# EAGLE schematic bread-supply_v0 (EAGLE 5.07)
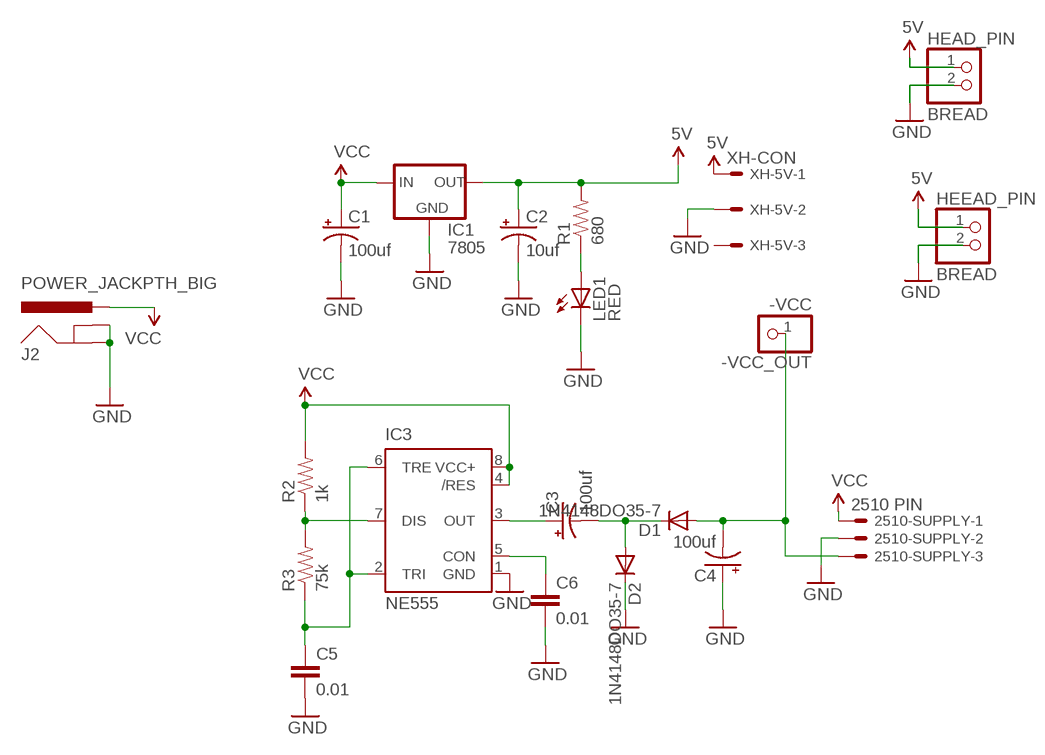
[diagram p0: schematic, sheet 1]

## Parts
2510-SUPPLY  2510 PIN  22-23-2031  [22-23-2031]
-VCC_OUT  -VCC  PINHD-1X1  [1X01]
C1  100uf  CAP_POLPTH1  [CPOL-RADIAL-100UF-25V]
C2  10uf  CAP_POLPTH2  [CPOL-RADIAL-10UF-25V]
C3  100uf  CAP_POLPTH1  [CPOL-RADIAL-100UF-25V]
C4  100uf  CAP_POLPTH1  [CPOL-RADIAL-100UF-25V]
C5  0.01  CAPPTH  [CAP-PTH-SMALL]
C6  0.01  CAPPTH  [CAP-PTH-SMALL]
D1  1N4148DO35-7  [DO35-7]
D2  1N4148DO35-7  [DO35-7]
HEAD_PIN  BREAD  PINHD-1X2  [1X02]
HEEAD_PIN  BREAD  PINHD-1X2  [1X02]
IC1  7805  V_REG_78XXSIDE  [78XXL]
IC3  NE555  [DIL-08]
J2  POWER_JACKPTH_BIG  [POWER_JACK_2.1X5.5_BIG_PTH]
LED1  RED  LED3MM  [LED3MM]
R1  680  RESISTORPTH1  [AXIAL-0.3]
R2  1k  RESISTORPTH1  [AXIAL-0.3]
R3  75k  RESISTORPTH1  [AXIAL-0.3]
XH-5V  XH-CON  22-27-2031-03  [6410-03]

## Nets
5V: C2.1(+) HEAD_PIN.1 HEEAD_PIN.1 IC1.OUT R1.P$2 XH-5V.1
GND: 2510-SUPPLY.2 C1.2(-) C2.2(-) C4.1(+) C5.2 C6.2 D2.C HEAD_PIN.2 HEEAD_PIN.2 IC1.GND IC3.1(GND) J2.GND J2.GNDBREAK LED1.K(C) XH-5V.2
N$2: IC3.7(DIS) R2.P$1 R3.P$2
N$3: C5.1 IC3.2(TRI) IC3.6(TRE) R3.P$1
N$5: C6.1 IC3.5(CON)
N$6: C3.1(+) IC3.3(OUT)
N$7: C3.2(-) D1.C D2.A
N$8: 2510-SUPPLY.3 -VCC_OUT.1 C4.2(-) D1.A
N$10: LED1.A R1.P$1
VCC: 2510-SUPPLY.1 C1.1(+) IC1.IN IC3.4(/RES) IC3.8(VCC+) J2.PWR R2.P$2
Unconnected: XH-5V.3

## Library data of the parts
2510-SUPPLY = con-molex:22-23-2031: .100" (2.54mm) Center Header - 3 Pin
-VCC_OUT = pinhead:PINHD-1X1: PIN HEADER
C1-C4 = SparkFun:CAP_POL: Capacitor Polarized These are standard SMD and PTH capacitors. Normally 10uF, 47uF, and 100uF in electrolytic and tantalum varieties. Always verify the external diameter of the through hole cap, it varies with capacity, voltage, and manufacturer. The EIA devices should be standard.
C5 C6 = SparkFun:CAP: Capacitor Standard 0603 ceramic capacitor, and 0.1" leaded capacitor.
D1 D2 = diode:1N4148: DIODE high speed (Philips)
HEAD_PIN HEEAD_PIN = pinhead:PINHD-1X2: PIN HEADER
IC1 = SparkFun:V_REG_78XX: Voltage Regulator Standard 7805 5V regulator. IGO (Input Ground Output). Spark Fun Electronics SKU : COM-00107
IC3 = st-microelectronics:NE555: General purpose bipolar Timer
J2 = digital-toy:POWER_JACK: Power Jack This is the standard 5.5mm barrel jack for power. The PTH is the most common, proven, reliable, footprint. All others are experimental. The Slot footprint only works if the mill layer is transmitted to the PCB fab house so be warned. Spark Fun Electronics SKU : PRT-00119. Mating wall wart : TOL-00298 (and others)
LED1 = SparkFun:LED: LEDs Standard schematic elements and footprints for 5mm, 3mm, 1206, and 0603 sized LEDs. 5mm - Spark Fun Electronics SKU : COM-00529 (and others)
R1-R3 = SparkFun:RESISTOR: Resistor Basic schematic elements and footprints for 0603, 1206, and PTH 1/10th watt (small) resistors.
XH-5V = con-molex:22-?-03: CONNECTOR wire to board 2.54 mm (.1 inch) pitch header